# EasyEDA Pro project miniMQ.epro, schematic Encoder-Controller
Board Name: Encoder-Controller; Create Date: 2026-09-02; Page Name: P1; Project Name: MagicQ Compact Mini Connect; Schematic Name: Encoder-Controller; Update Date: 2026-09-17; Company: EasyEDA.com; Page Size: A4; Version: V1.0
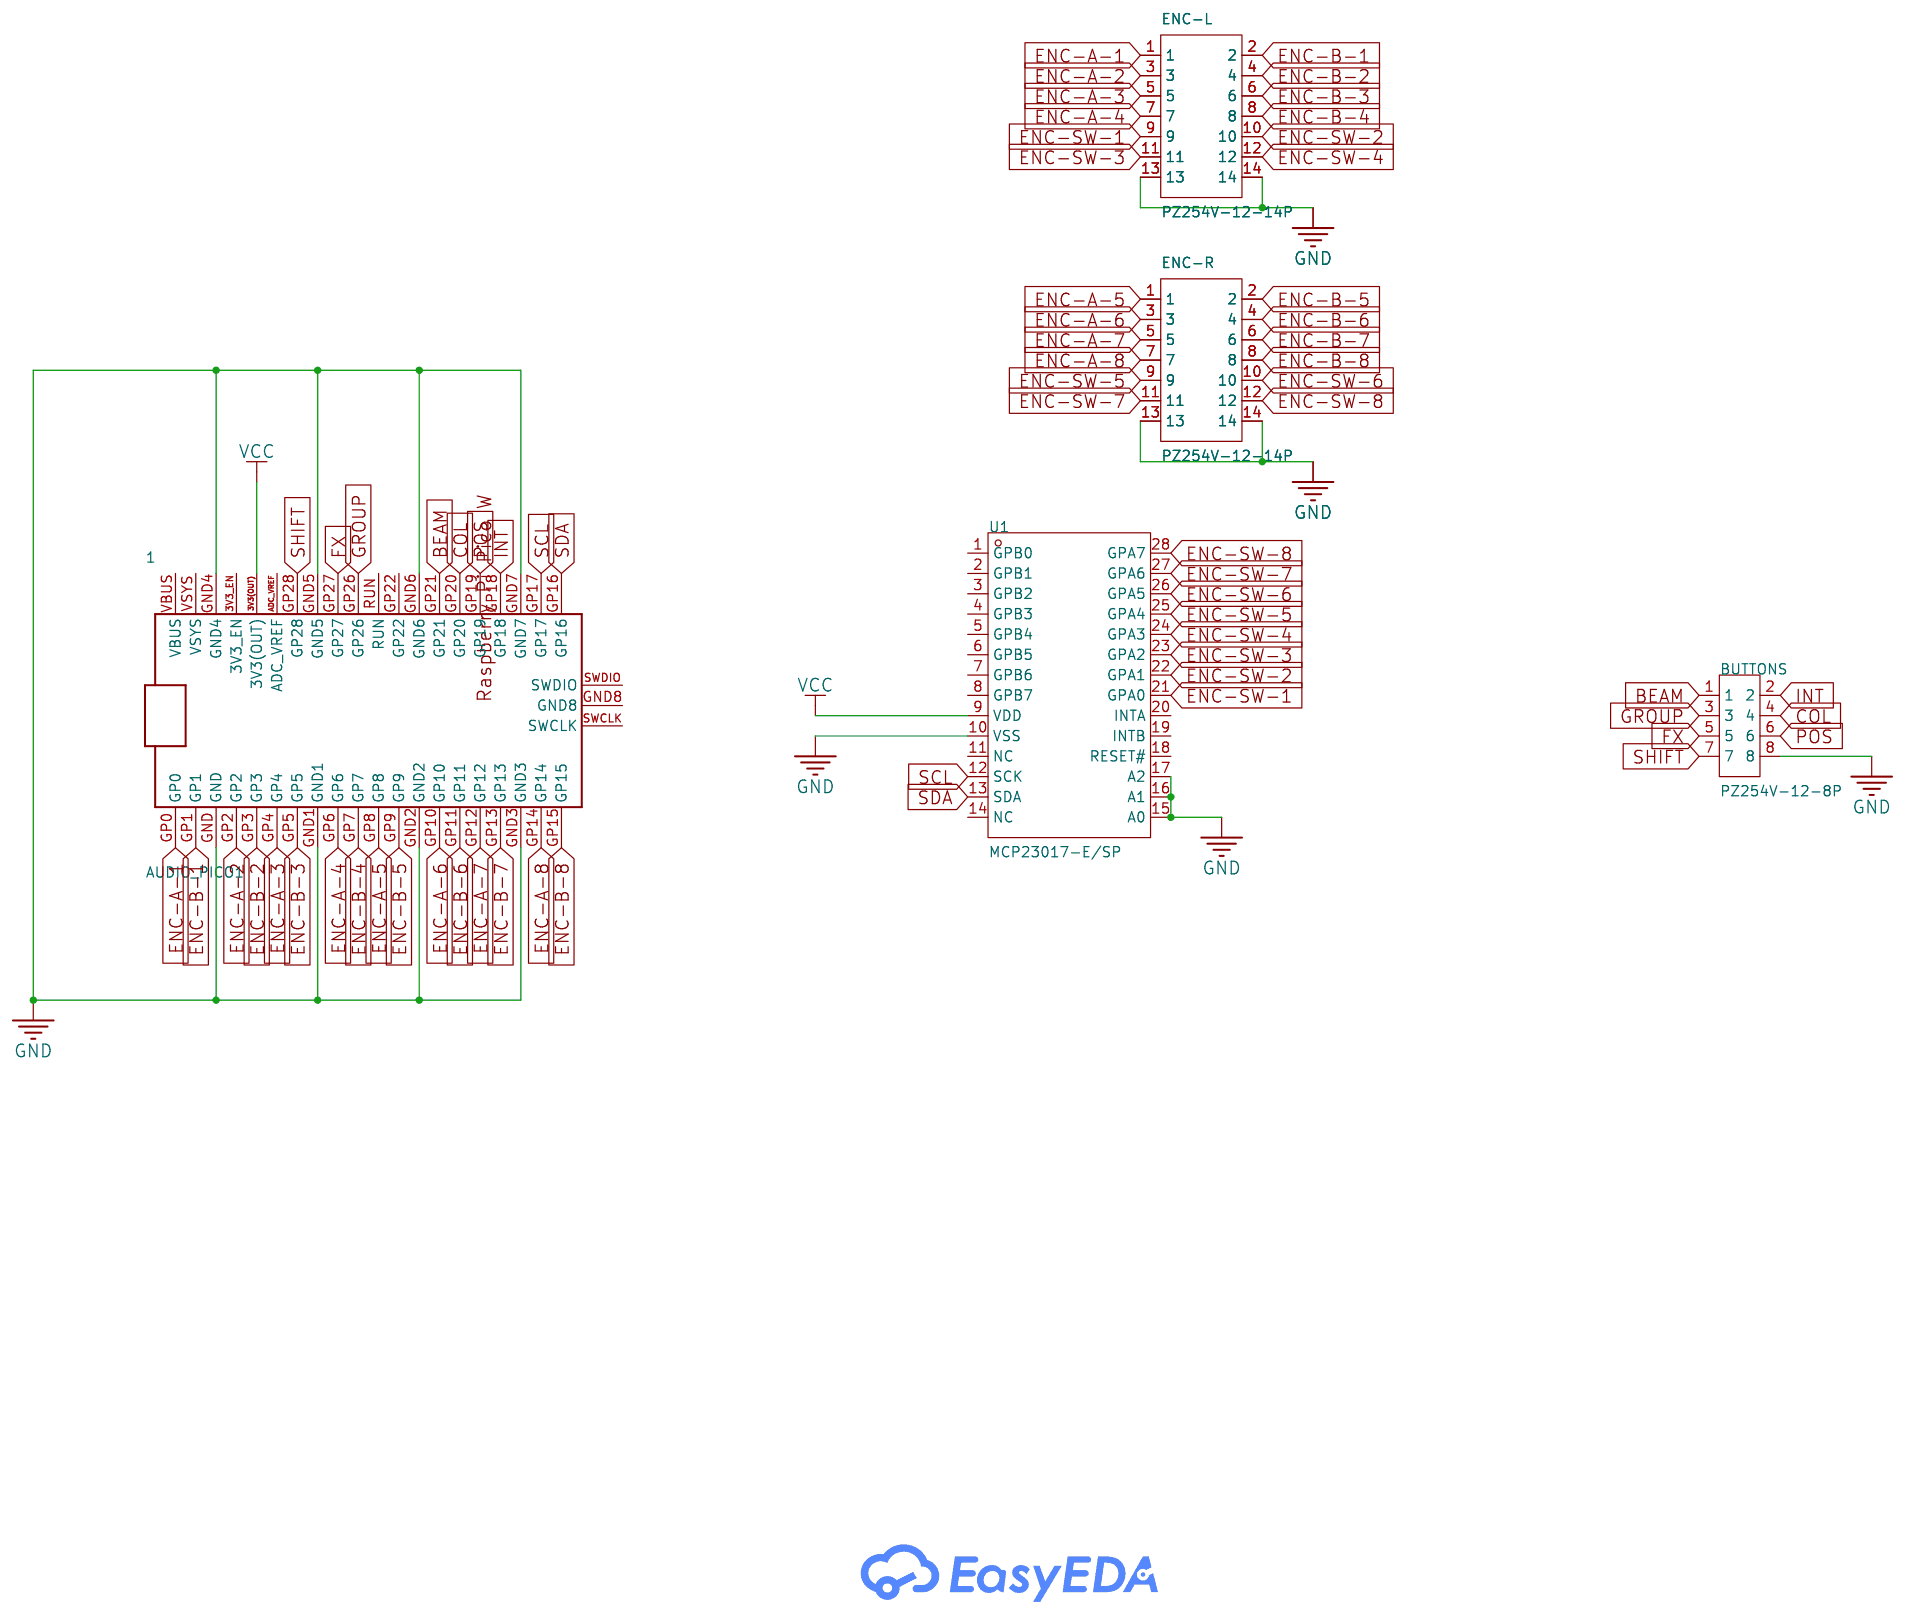
[diagram p2: schematic sheet]

## Parts
1  AUDIO_PICO1  [RASPBERRYPIPICO]
BUTTONS  PZ254V-12-8P  [HDR-TH_8P-P2.54-V-M-R2-C4-S2.54]
ENC-L  PZ254V-12-14P  [HDR-TH_14P-P2.54-V-M-R2-C7-S2.54]
ENC-R  PZ254V-12-14P  [HDR-TH_14P-P2.54-V-M-R2-C7-S2.54]
U1  MCP23017-E/SP  [DIP-28_L34.6-W7.3-P2.54-LS10.2-BL]

## Library data of the parts
1 = AUDIO_PICO1: Manufacturer Part: RASPBERRY PI PICO; Supplier: Element14; Supplier Part: 3643332; Manufacturer: Raspberry-PI; link: https://se.farnell.com/b/raspberry-pi
BUTTONS = PZ254V-12-8P: Pin Structure:2x4P Pitch:2.54mm Row Spacing:2.54mm Circluar Pins/Square Pins:Pin Header Mounting Type:Through Hole Number of Rows:2 Number of Pins:8P Current Rating:- Voltage Rating (Max):- Length of Mating Pin:6mm Insulation Height:2.5mm Length of End Co; LCSC Part Name: 2x4P 间距:2.54mm 方针 直插; Supplier Part: C492421; Manufacturer: XFCN(兴飞); Supplier Footprint: 插件,P=2.54mm; JLCPCB Part Class: Extended Part; Datasheet: https://item.szlcsc.com/datasheet/PZ254V-12-8P/502977.html; Supplier: LCSC; Pin Structure: 2x4P; Pitch: 2.54mm; Row Spacing: 2.54mm; Circluar Pins/Square Pins: Pin Header; Mounting Type: Through Hole; Number of Rows: 2; Number of Pins: 8P; Length of Mating Pin: 6mm; Insulation Height: 2.5mm; Length of End Connection Pin: 3mm; Contact Material: Brass; Operating Temperature: -40℃~+105℃; Color: Black
ENC-L ENC-R = PZ254V-12-14P: Pin Structure:2x7P Pitch:2.54mm Row Spacing:2.54mm Circluar Pins/Square Pins:Pin Header Mounting Type:Through Hole Number of Rows:2 Number of Pins:14P Current Rating:- Voltage Rating (Max):- Length of Mating Pin:6mm Insulation Height:2.5mm Length of End C; LCSC Part Name: 2x7P 间距:2.54mm 方针 直插; Supplier Part: C492424; Manufacturer: XFCN(兴飞); Supplier Footprint: 插件,P=2.54mm; JLCPCB Part Class: Extended Part; Datasheet: https://item.szlcsc.com/datasheet/PZ254V-12-14P/502980.html; Supplier: LCSC; Pin Structure: 2x7P; Pitch: 2.54mm; Row Spacing: 2.54mm; Circluar Pins/Square Pins: Pin Header; Mounting Type: Through Hole; Number of Rows: 2; Number of Pins: 14P; Length of Mating Pin: 6mm; Insulation Height: 2.5mm; Length of End Connection Pin: 3mm; Contact Material: Brass; Operating Temperature: -40℃~+105℃; Color: Black
U1 = MCP23017-E/SP: Interface:I2C Interrupt Output:Interrupt Output Output Type:- Voltage - Supply:1.8V~5.5V Voltage - Supply:1.8V~5.5V Current - Output Low(IOL):- Current - Output High(IOH):- Clock Frequency:1.7MHz Operating Temperature:-40℃~+125℃ Operating Temperature:-40℃; LCSC Part Name: 16位带串行接口的I/O扩展器; Supplier Part: C647352; Manufacturer: MICROCHIP(美国微芯); Supplier Footprint: SPDIP-28; JLCPCB Part Class: Extended Part; Datasheet: https://item.szlcsc.com/datasheet/MCP23017-E%252FSP/676855.html; Supplier: LCSC; Interface: I2C; Interrupt Output: Interrupt Output; Voltage - Supply: 1.8V~5.5V; Clock Frequency: 1.7MHz; Operating Temperature: -40℃~+125℃

## Nets
GND: 1.GND 1.GND1 1.GND2 1.GND3 1.GND4 1.GND5 1.GND6 1.GND7 BUTTONS.8 ENC-L.13 ENC-L.14 ENC-R.13 ENC-R.14 U1.10(VSS) U1.15(A0) U1.16(A1) U1.17(A2)
VCC: 1.3V3(OUT) U1.9(VDD)
BEAM: 1.GP21 BUTTONS.1
COL: 1.GP20 BUTTONS.4
ENC-A-1: 1.GP0 ENC-L.1
ENC-A-2: 1.GP2 ENC-L.3
ENC-A-3: 1.GP4 ENC-L.5
ENC-A-4: 1.GP6 ENC-L.7
ENC-A-5: 1.GP8 ENC-R.1
ENC-A-6: 1.GP10 ENC-R.3
ENC-A-7: 1.GP12 ENC-R.5
ENC-A-8: 1.GP14 ENC-R.7
ENC-B-1: 1.GP1 ENC-L.2
ENC-B-2: 1.GP3 ENC-L.4
ENC-B-3: 1.GP5 ENC-L.6
ENC-B-4: 1.GP7 ENC-L.8
ENC-B-5: 1.GP9 ENC-R.2
ENC-B-6: 1.GP11 ENC-R.4
ENC-B-7: 1.GP13 ENC-R.6
ENC-B-8: 1.GP15 ENC-R.8
ENC-SW-1: ENC-L.9 U1.21(GPA0)
ENC-SW-2: ENC-L.10 U1.22(GPA1)
ENC-SW-3: ENC-L.11 U1.23(GPA2)
ENC-SW-4: ENC-L.12 U1.24(GPA3)
ENC-SW-5: ENC-R.9 U1.25(GPA4)
ENC-SW-6: ENC-R.10 U1.26(GPA5)
ENC-SW-7: ENC-R.11 U1.27(GPA6)
ENC-SW-8: ENC-R.12 U1.28(GPA7)
FX: 1.GP27 BUTTONS.5
GROUP: 1.GP26 BUTTONS.3
INT: 1.GP18 BUTTONS.2
POS: 1.GP19 BUTTONS.6
SCL: 1.GP17 U1.12(SCK)
SDA: 1.GP16 U1.13(SDA)
SHIFT: 1.GP28 BUTTONS.7

Not connected (* = marked no-connect by the designer): 1 3V3_EN ADC_VREF GND8 GP22 RUN SWCLK SWDIO VBUS VSYS; U1 1(GPB0) 2(GPB1) 3(GPB2) 4(GPB3) 5(GPB4) 6(GPB5) 7(GPB6) 8(GPB7) 11(NC) 14(NC) 18(RESET#) 19(INTB) 20(INTA)
